# EAGLE schematic final_project (EAGLE 7.3.0)
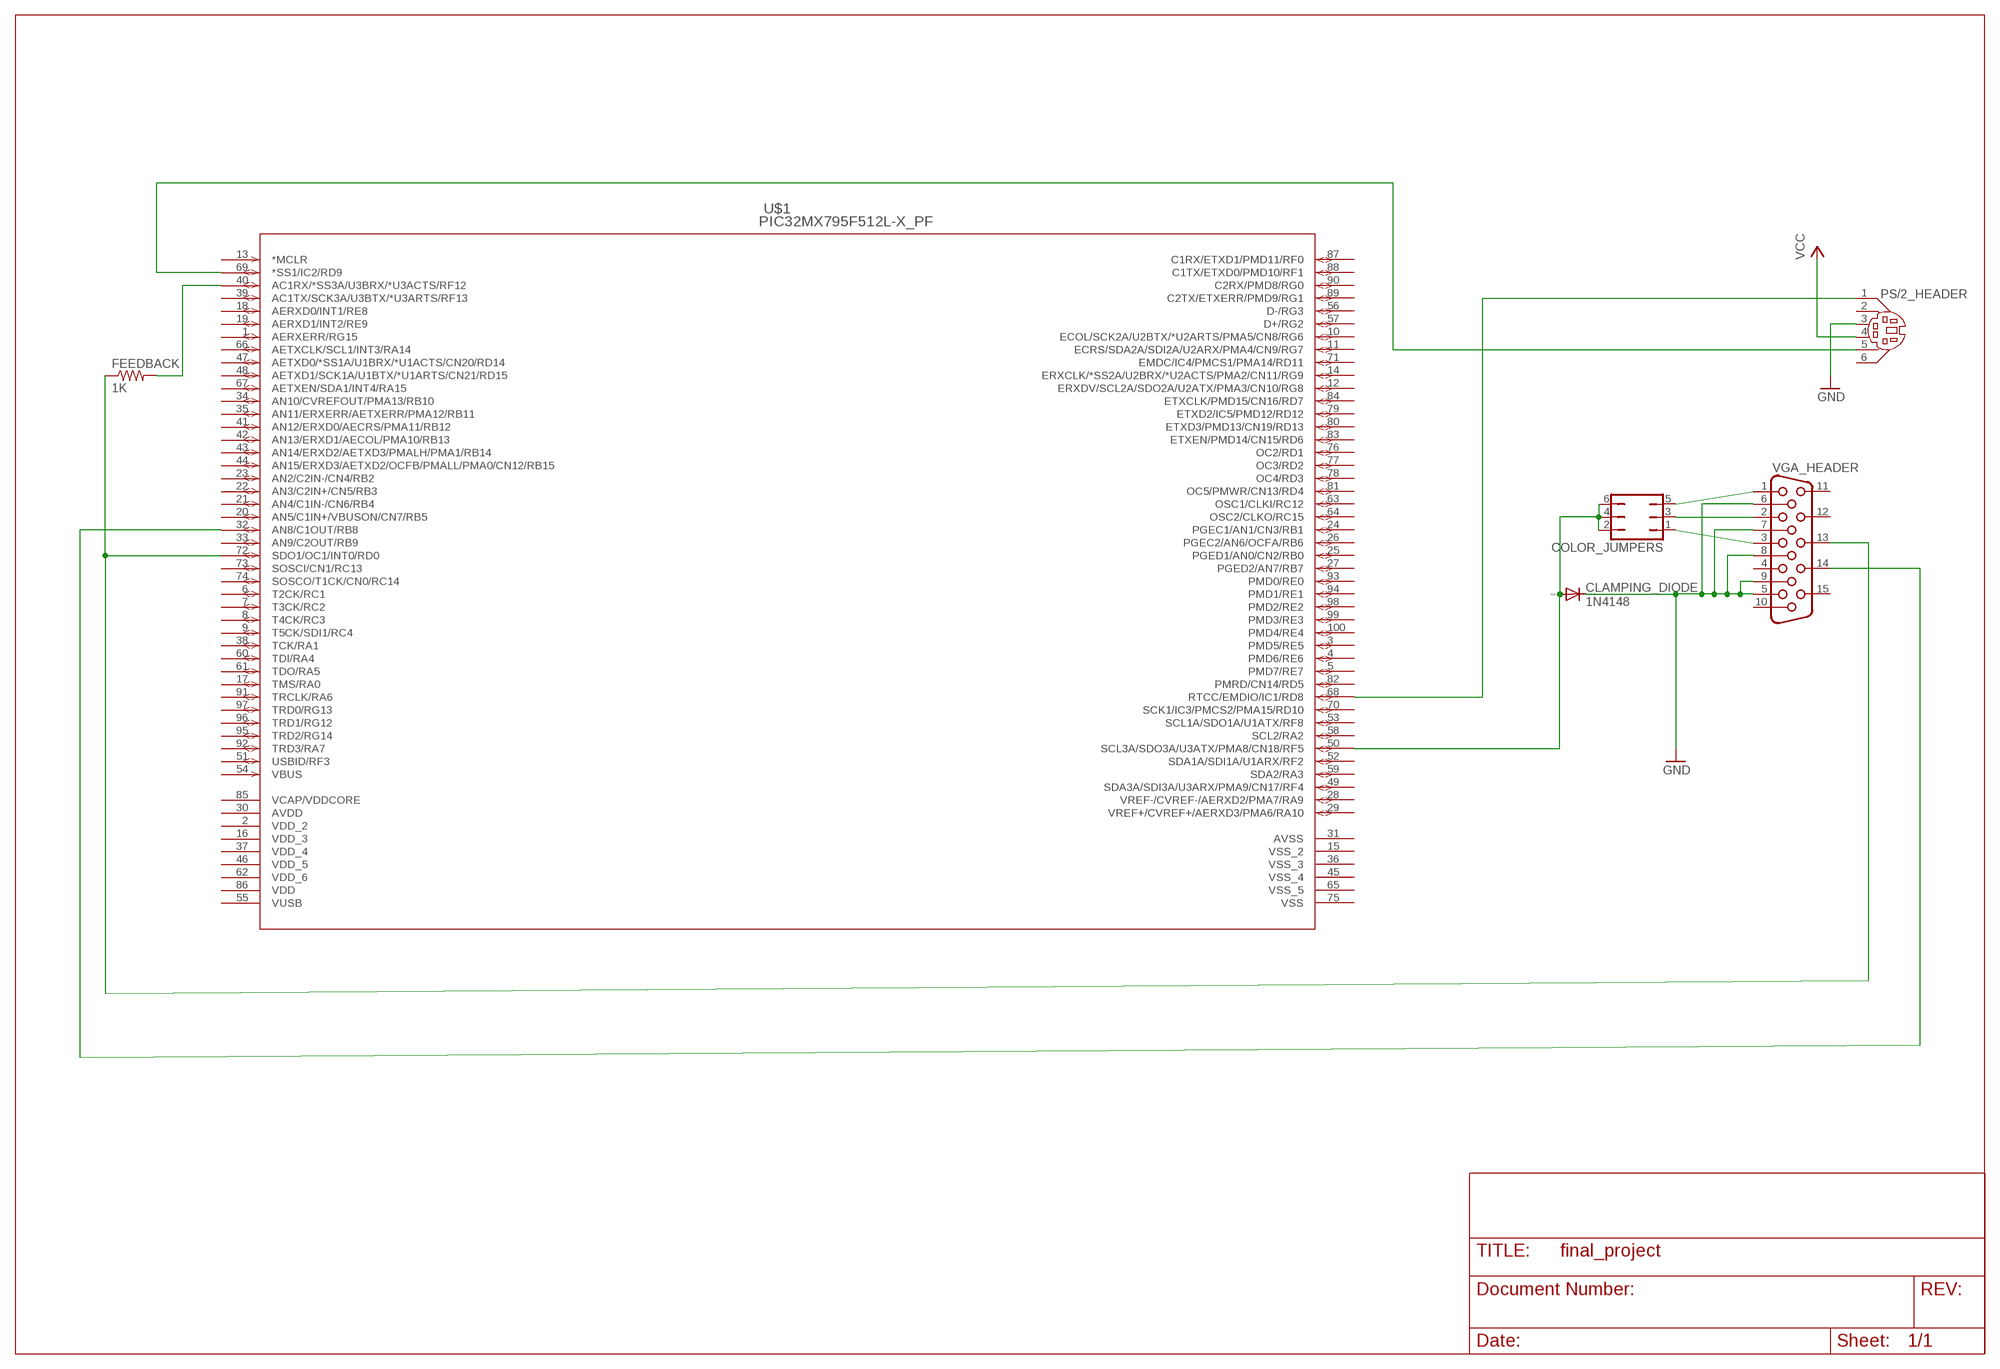
[diagram p0: schematic, sheet 1]

## Parts
CLAMPING_DIODE  1N4148  1N4004  [DO41-10]
COLOR_JUMPERS  JP3Q  [JP3Q]
FEEDBACK  1K  R-US_0204/2V  [0204V]
PS/2_HEADER  MDIN06K  [MDIN06K]
U$1  PIC32MX795F512L-X_PF  [TQFP100_14X14MC]
VGA_HEADER  HF15H  [HDF15H]

## Nets
GND: CLAMPING_DIODE.C PS/2_HEADER.3 VGA_HEADER.5 VGA_HEADER.6 VGA_HEADER.7 VGA_HEADER.8 VGA_HEADER.9
N$2: COLOR_JUMPERS.5 VGA_HEADER.1
N$3: COLOR_JUMPERS.3 VGA_HEADER.2
N$4: COLOR_JUMPERS.1 VGA_HEADER.3
N$5: CLAMPING_DIODE.A COLOR_JUMPERS.2 COLOR_JUMPERS.4 COLOR_JUMPERS.6 U$1.50(SCL3A/SDO3A/U3ATX/PMA8/CN18/RF5)
N$6: U$1.32(AN8/C1OUT/RB8) VGA_HEADER.14
N$7: FEEDBACK.1 VGA_HEADER.13
N$8: PS/2_HEADER.1 U$1.68(RTCC/EMDIO/IC1/RD8)
N$9: PS/2_HEADER.5 U$1.69(*SS1/IC2/RD9)
N$10: FEEDBACK.2 U$1.40(AC1RX/*SS3A/U3BRX/*U3ACTS/RF12)
VCC: PS/2_HEADER.4
Unconnected: PS/2_HEADER.2 PS/2_HEADER.6 U$1.1(AERXERR/RG15) U$1.3(PMD5/RE5) U$1.4(PMD6/RE6) U$1.5(PMD7/RE7) U$1.6(T2CK/RC1) U$1.7(T3CK/RC2) U$1.8(T4CK/RC3) U$1.9(T5CK/SDI1/RC4) U$1.10(ECOL/SCK2A/U2BTX/*U2ARTS/PMA5/CN8/RG6) U$1.11(ECRS/SDA2A/SDI2A/U2ARX/PMA4/CN9/RG7) U$1.12(ERXDV/SCL2A/SDO2A/U2ATX/PMA3/CN10/RG8) U$1.13(*MCLR) U$1.14(ERXCLK/*SS2A/U2BRX/*U2ACTS/PMA2/CN11/RG9) U$1.17(TMS/RA0) U$1.18(AERXD0/INT1/RE8) U$1.19(AERXD1/INT2/RE9) U$1.20(AN5/C1IN+/VBUSON/CN7/RB5) U$1.21(AN4/C1IN-/CN6/RB4) U$1.22(AN3/C2IN+/CN5/RB3) U$1.23(AN2/C2IN-/CN4/RB2) U$1.24(PGEC1/AN1/CN3/RB1) U$1.25(PGED1/AN0/CN2/RB0) U$1.26(PGEC2/AN6/OCFA/RB6) U$1.27(PGED2/AN7/RB7) U$1.28(VREF-/CVREF-/AERXD2/PMA7/RA9) U$1.29(VREF+/CVREF+/AERXD3/PMA6/RA10) U$1.33(AN9/C2OUT/RB9) U$1.34(AN10/CVREFOUT/PMA13/RB10) U$1.35(AN11/ERXERR/AETXERR/PMA12/RB11) U$1.38(TCK/RA1) U$1.39(AC1TX/SCK3A/U3BTX/*U3ARTS/RF13) U$1.41(AN12/ERXD0/AECRS/PMA11/RB12) U$1.42(AN13/ERXD1/AECOL/PMA10/RB13) U$1.43(AN14/ERXD2/AETXD3/PMALH/PMA1/RB14) U$1.44(AN15/ERXD3/AETXD2/OCFB/PMALL/PMA0/CN12/RB15) U$1.47(AETXD0/*SS1A/U1BRX/*U1ACTS/CN20/RD14) U$1.48(AETXD1/SCK1A/U1BTX/*U1ARTS/CN21/RD15) U$1.49(SDA3A/SDI3A/U3ARX/PMA9/CN17/RF4) U$1.51(USBID/RF3) U$1.52(SDA1A/SDI1A/U1ARX/RF2) U$1.53(SCL1A/SDO1A/U1ATX/RF8) U$1.54(VBUS) U$1.56(D-/RG3) U$1.57(D+/RG2) U$1.58(SCL2/RA2) U$1.59(SDA2/RA3) U$1.60(TDI/RA4) U$1.61(TDO/RA5) U$1.63(OSC1/CLKI/RC12) U$1.64(OSC2/CLKO/RC15) U$1.66(AETXCLK/SCL1/INT3/RA14) U$1.67(AETXEN/SDA1/INT4/RA15) U$1.70(SCK1/IC3/PMCS2/PMA15/RD10) U$1.71(EMDC/IC4/PMCS1/PMA14/RD11) U$1.72(SDO1/OC1/INT0/RD0) U$1.73(SOSCI/CN1/RC13) U$1.74(SOSCO/T1CK/CN0/RC14) U$1.76(OC2/RD1) U$1.77(OC3/RD2) U$1.78(OC4/RD3) U$1.79(ETXD2/IC5/PMD12/RD12) U$1.80(ETXD3/PMD13/CN19/RD13) U$1.81(OC5/PMWR/CN13/RD4) U$1.82(PMRD/CN14/RD5) U$1.83(ETXEN/PMD14/CN15/RD6) U$1.84(ETXCLK/PMD15/CN16/RD7) U$1.87(C1RX/ETXD1/PMD11/RF0) U$1.88(C1TX/ETXD0/PMD10/RF1) U$1.89(C2TX/ETXERR/PMD9/RG1) U$1.90(C2RX/PMD8/RG0) U$1.91(TRCLK/RA6) U$1.92(TRD3/RA7) U$1.93(PMD0/RE0) U$1.94(PMD1/RE1) U$1.95(TRD2/RG14) U$1.96(TRD1/RG12) U$1.97(TRD0/RG13) U$1.98(PMD2/RE2) U$1.99(PMD3/RE3) U$1.100(PMD4/RE4) VGA_HEADER.4 VGA_HEADER.10 VGA_HEADER.11 VGA_HEADER.12 VGA_HEADER.15

## Power pins joined to a net without a drawn wire
AVDD: U$1.30(AVDD)
AVSS: U$1.31(AVSS)
VCAP/VDDCORE: U$1.85(VCAP/VDDCORE)
VDD: U$1.86(VDD)
VDD_2: U$1.2(VDD_2)
VDD_3: U$1.16(VDD_3)
VDD_4: U$1.37(VDD_4)
VDD_5: U$1.46(VDD_5)
VDD_6: U$1.62(VDD_6)
VSS: U$1.75(VSS)
VSS_2: U$1.15(VSS_2)
VSS_3: U$1.36(VSS_3)
VSS_4: U$1.45(VSS_4)
VSS_5: U$1.65(VSS_5)
VUSB: U$1.55(VUSB)

## Library data of the parts
CLAMPING_DIODE = diode:1N4004: DIODE general purpose rectifier, 1 A
COLOR_JUMPERS = jumper:JP3Q: JUMPER
FEEDBACK = resistor:R-US_: RESISTOR, American symbol
PS/2_HEADER = con-yamaichi:MDIN06K: YAMAICHI CONNECTOR; OC_FARNELL: unknown; OC_NEWARK: unknown
U$1 = PIC32MX795F512L:PIC32MX795F512L-X_PF
VGA_HEADER = con-subd:HF15: SUB-D; OC_FARNELL: unknown; OC_NEWARK: unknown